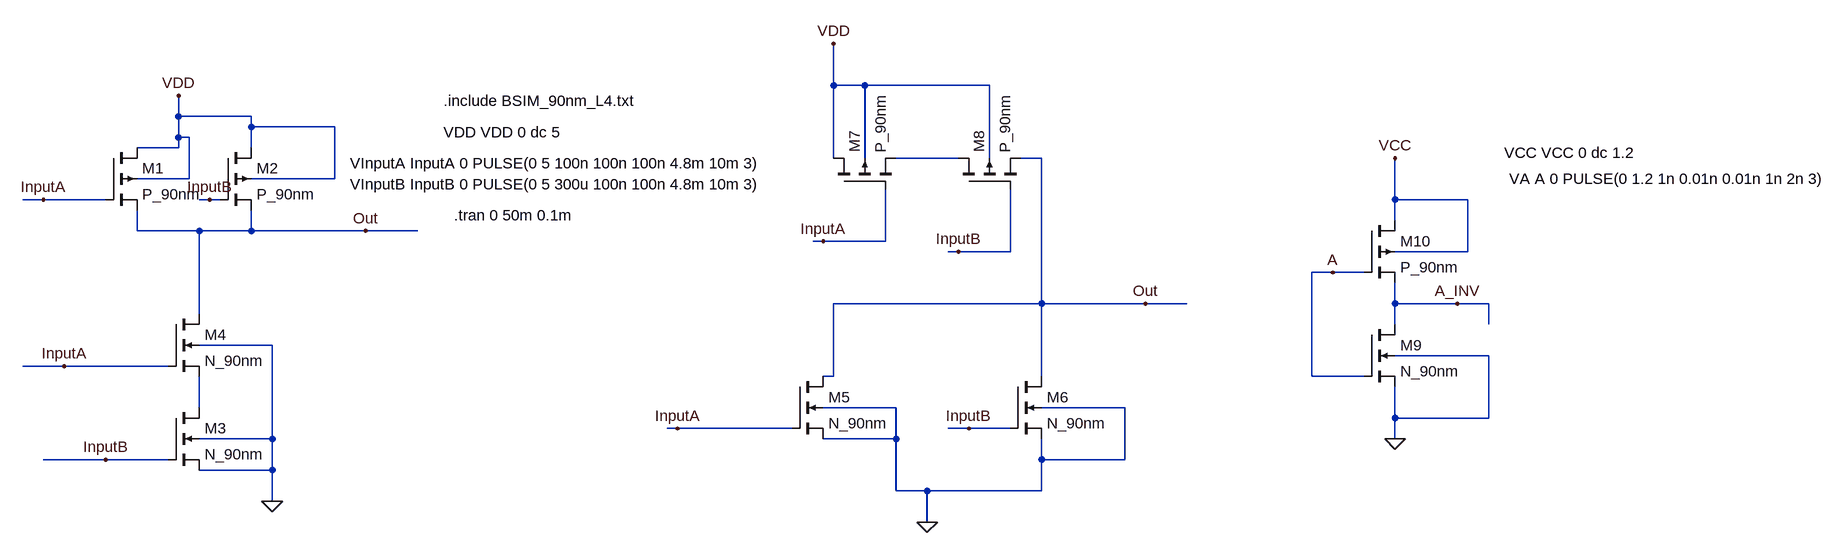
[diagram p0: schematic Part2.asc]
Part2.asc, the LTspice schematic file:
Version 4
SHEET 1 2420 680
WIRE -144 -480 -144 -544
WIRE -96 -480 -144 -480
WIRE 96 -480 -96 -480
WIRE -1152 -432 -1152 -464
WIRE -1040 -432 -1152 -432
WIRE -1040 -416 -1040 -432
WIRE -912 -416 -1040 -416
WIRE -1152 -400 -1152 -432
WIRE -1136 -400 -1152 -400
WIRE -1152 -384 -1152 -400
WIRE -1152 -384 -1216 -384
WIRE -1040 -384 -1040 -416
WIRE -144 -368 -144 -480
WIRE -96 -368 -96 -480
WIRE 48 -368 -48 -368
WIRE 96 -368 96 -480
WIRE 176 -368 144 -368
WIRE -1136 -336 -1136 -400
WIRE -1136 -336 -1216 -336
WIRE -912 -336 -912 -416
WIRE -912 -336 -1040 -336
WIRE -1360 -304 -1392 -304
WIRE -1264 -304 -1360 -304
WIRE -1104 -304 -1120 -304
WIRE -1088 -304 -1104 -304
WIRE 720 -304 720 -368
WIRE 832 -304 720 -304
WIRE 720 -272 720 -304
WIRE -1216 -256 -1216 -288
WIRE -1120 -256 -1216 -256
WIRE -1040 -256 -1040 -288
WIRE -1040 -256 -1120 -256
WIRE -864 -256 -1040 -256
WIRE -784 -256 -864 -256
WIRE -160 -240 -176 -240
WIRE -64 -240 -64 -320
WIRE -64 -240 -160 -240
WIRE 48 -224 32 -224
WIRE 128 -224 128 -320
WIRE 128 -224 48 -224
WIRE 832 -224 832 -304
WIRE 832 -224 720 -224
WIRE 624 -192 592 -192
WIRE 672 -192 624 -192
WIRE 176 -144 176 -368
WIRE 176 -144 -144 -144
WIRE 336 -144 176 -144
WIRE 400 -144 336 -144
WIRE 720 -144 720 -176
WIRE 816 -144 720 -144
WIRE 864 -144 816 -144
WIRE -1120 -128 -1120 -256
WIRE 720 -112 720 -144
WIRE 864 -112 864 -144
WIRE -1008 -80 -1120 -80
WIRE 864 -64 720 -64
WIRE -1328 -48 -1392 -48
WIRE -1168 -48 -1328 -48
WIRE -144 -32 -144 -144
WIRE -144 -32 -160 -32
WIRE 176 -32 176 -144
WIRE 592 -32 592 -192
WIRE 672 -32 592 -32
WIRE -1120 16 -1120 -32
WIRE -48 16 -160 16
WIRE 304 16 176 16
WIRE 720 32 720 -16
WIRE 864 32 864 -64
WIRE 864 32 720 32
WIRE -384 48 -400 48
WIRE -208 48 -384 48
WIRE 64 48 32 48
WIRE 128 48 64 48
WIRE -1008 64 -1008 -80
WIRE -1008 64 -1120 64
WIRE -48 64 -48 16
WIRE -48 64 -160 64
WIRE 720 64 720 32
WIRE -1264 96 -1360 96
WIRE -1168 96 -1264 96
WIRE 176 96 176 64
WIRE 304 96 304 16
WIRE 304 96 176 96
WIRE -1008 112 -1008 64
WIRE -1008 112 -1120 112
WIRE -48 144 -48 64
WIRE 0 144 -48 144
WIRE 176 144 176 96
WIRE 176 144 0 144
WIRE -1008 160 -1008 112
WIRE 0 192 0 144
FLAG -1152 -464 VDD
FLAG -1360 -304 InputA
FLAG -1328 -48 InputA
FLAG -1264 96 InputB
FLAG -1104 -304 InputB
FLAG -1008 160 0
FLAG -864 -256 Out
FLAG 0 192 0
FLAG -144 -544 VDD
FLAG -160 -240 InputA
FLAG -384 48 InputA
FLAG 48 -224 InputB
FLAG 64 48 InputB
FLAG 336 -144 Out
FLAG 624 -192 A
FLAG 816 -144 A_INV
FLAG 720 64 0
FLAG 720 -368 VCC
SYMBOL pmos4 -1264 -384 R0
SYMATTR InstName M1
SYMATTR Value P_90nm
SYMATTR Value2 l=90nm w=1800nm
SYMBOL pmos4 -1088 -384 R0
SYMATTR InstName M2
SYMATTR Value P_90nm
SYMATTR Value2 l=90nm w=1800nm
SYMBOL nmos4 -1168 -128 R0
SYMATTR InstName M4
SYMATTR Value N_90nm
SYMATTR Value2 l=90nm w=1800nm
SYMBOL nmos4 -1168 16 R0
SYMATTR InstName M3
SYMATTR Value N_90nm
SYMATTR Value2 l=90nm w=1800nm
SYMBOL nmos4 -208 -32 R0
SYMATTR InstName M5
SYMATTR Value N_90nm
SYMATTR Value2 l=90nm w=900nm
SYMBOL nmos4 128 -32 R0
SYMATTR InstName M6
SYMATTR Value N_90nm
SYMATTR Value2 l=90nm w=900nm
SYMBOL pmos4 -144 -320 R270
SYMATTR InstName M7
SYMATTR Value P_90nm
SYMATTR Value2 l=90nm w=3600nm
SYMBOL pmos4 48 -320 R270
SYMATTR InstName M8
SYMATTR Value P_90nm
SYMATTR Value2 l=90nm w=3600nm
SYMBOL nmos4 672 -112 R0
SYMATTR InstName M9
SYMATTR Value N_90nm
SYMATTR Value2 l=90nm w=400nm
SYMBOL pmos4 672 -272 R0
SYMATTR InstName M10
SYMATTR Value P_90nm
SYMATTR Value2 l=90nm w=800nm
TEXT -744 -456 Left 2 !.include BSIM_90nm_L4.txt
TEXT -744 -408 Left 2 !VDD VDD 0 dc 5
TEXT -888 -360 Left 2 !VInputA InputA 0 PULSE(0 5 100n 100n 100n 4.8m 10m 3)
TEXT -888 -328 Left 2 !VInputB InputB 0 PULSE(0 5 300u 100n 100n 4.8m 10m 3)
TEXT -728 -280 Left 2 !.tran 0 50m 0.1m
TEXT 888 -376 Left 2 !VCC VCC 0 dc 1.2
TEXT 896 -336 Left 2 !VA A 0 PULSE(0 1.2 1n 0.01n 0.01n 1n 2n 3)

The netlist it stands for:
* Part2.asc
M1 VDD InputA Out VDD P_90nm l=90nm w=1800nm
M2 VDD InputB Out VDD P_90nm l=90nm w=1800nm
M4 Out InputA N002 0 N_90nm l=90nm w=1800nm
M3 N002 InputB 0 0 N_90nm l=90nm w=1800nm
M5 Out InputA 0 0 N_90nm l=90nm w=900nm
M6 Out InputB 0 0 N_90nm l=90nm w=900nm
M7 VDD InputA N001 VDD P_90nm l=90nm w=3600nm
M8 N001 InputB Out VDD P_90nm l=90nm w=3600nm
M9 A_INV A 0 0 N_90nm l=90nm w=400nm
M10 VCC A A_INV VCC P_90nm l=90nm w=800nm
.model NMOS NMOS
.model PMOS PMOS
.lib standard.mos
.include BSIM_90nm_L4.txt
VDD VDD 0 dc 5
VInputA InputA 0 PULSE(0 5 100n 100n 100n 4.8m 10m 3)
VInputB InputB 0 PULSE(0 5 300u 100n 100n 4.8m 10m 3)
.tran 0 50m 0.1m
VCC VCC 0 dc 1.2
VA A 0 PULSE(0 1.2 1n 0.01n 0.01n 1n 2n 3)
.backanno
.end